# Altium schematic sheet 0031_DEBUG-XDP_SERIES_T.SchDoc
size A3
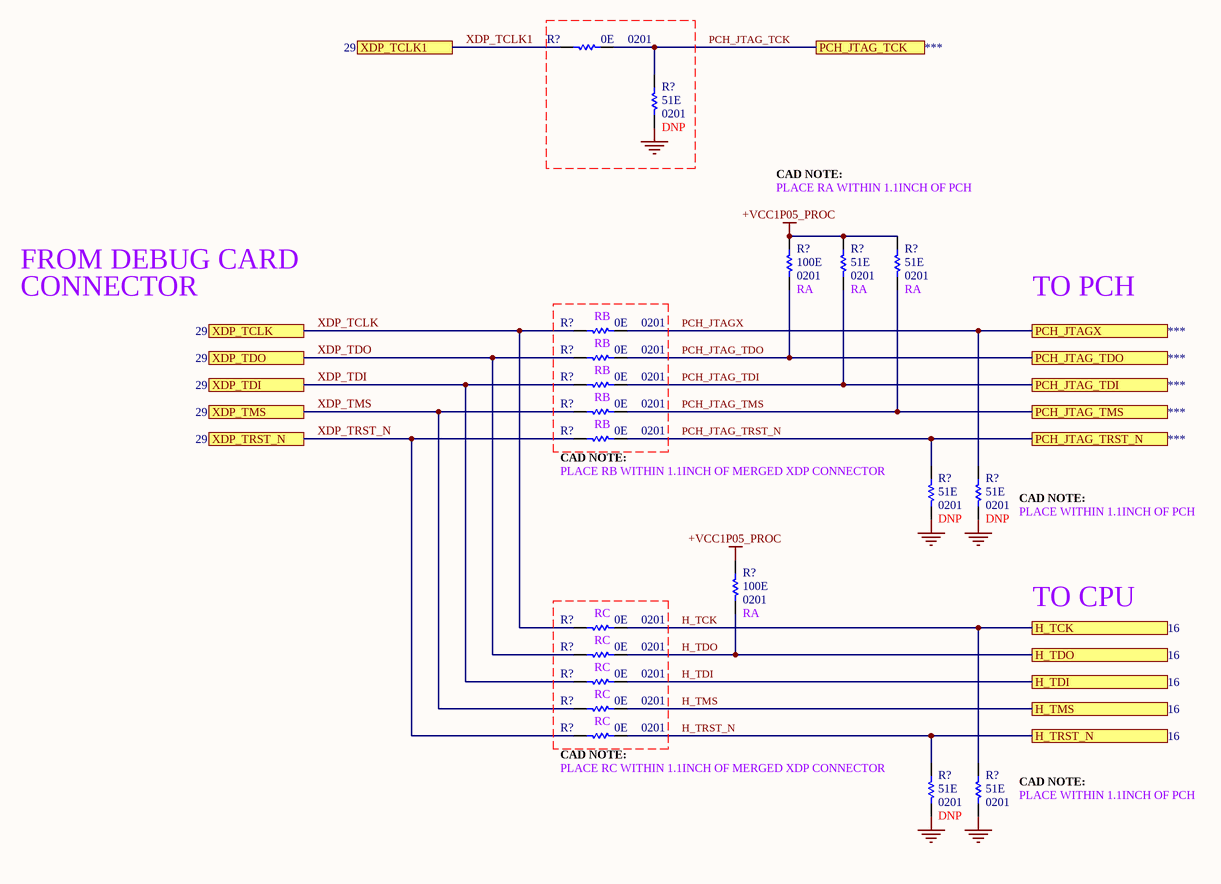
[diagram p0: 0031_DEBUG-XDP_SERIES_T.SchDoc]

## Parts
(Parts that share a designator on the sheet are numbered #1, #2 ... from top to bottom, then left to right.)
R?#1  value 0E  Case/Package: 0201  [RESC0201]  (hidden comment: Res)
R?#2  value 51E  Case/Package: 0201  [RESC0201]  (hidden comment: Res)
R?#3  value 100E  Case/Package: 0201  [RESC0201]  (hidden comment: Res)
R?#4  value 51E  Case/Package: 0201  [RESC0201]  (hidden comment: Res)
R?#5  value 51E  Case/Package: 0201  [RESC0201]  (hidden comment: Res)
R?#6  value 0E  Case/Package: 0201  [RESC0201]  (hidden comment: Res)
R?#7  value 0E  Case/Package: 0201  [RESC0201]  (hidden comment: Res)
R?#8  value 0E  Case/Package: 0201  [RESC0201]  (hidden comment: Res)
R?#9  value 0E  Case/Package: 0201  [RESC0201]  (hidden comment: Res)
R?#10  value 0E  Case/Package: 0201  [RESC0201]  (hidden comment: Res)
R?#11  value 51E  Case/Package: 0201  [RESC0201]  (hidden comment: Res)
R?#12  value 51E  Case/Package: 0201  [RESC0201]  (hidden comment: Res)
R?#13  value 100E  Case/Package: 0201  [RESC0201]  (hidden comment: Res)
R?#14  value 0E  Case/Package: 0201  [RESC0201]  (hidden comment: Res)
R?#15  value 0E  Case/Package: 0201  [RESC0201]  (hidden comment: Res)
R?#16  value 0E  Case/Package: 0201  [RESC0201]  (hidden comment: Res)
R?#17  value 0E  Case/Package: 0201  [RESC0201]  (hidden comment: Res)
R?#18  value 0E  Case/Package: 0201  [RESC0201]  (hidden comment: Res)
R?#19  value 51E  Case/Package: 0201  [RESC0201]  (hidden comment: Res)
R?#20  value 51E  Case/Package: 0201  [RESC0201]  (hidden comment: Res)

## Ports
H_TCK, H_TDI, H_TDO, H_TMS, H_TRST_N, PCH_JTAG_TCK, PCH_JTAG_TDI, PCH_JTAG_TDO, PCH_JTAG_TMS, PCH_JTAG_TRST_N, PCH_JTAGX, XDP_TCLK, XDP_TCLK1, XDP_TDI, XDP_TDO, XDP_TMS, XDP_TRST_N

## Nets
+VCC1P05_PROC: R?#3.2 R?#4.2 R?#5.2 R?#13.2
GND: R?#2.1 R?#11.1 R?#12.1 R?#19.1 R?#20.1
H_TCK: R?#14.2 R?#20.2 ; port H_TCK
H_TDI: R?#16.2 ; port H_TDI
H_TDO: R?#13.1 R?#15.2 ; port H_TDO
H_TMS: R?#17.2 ; port H_TMS
H_TRST_N: R?#18.2 R?#19.2 ; port H_TRST_N
PCH_JTAG_TCK: R?#1.2 R?#2.2 ; port PCH_JTAG_TCK
PCH_JTAG_TDI: R?#4.1 R?#8.2 ; port PCH_JTAG_TDI
PCH_JTAG_TDO: R?#3.1 R?#7.2 ; port PCH_JTAG_TDO
PCH_JTAG_TMS: R?#5.1 R?#9.2 ; port PCH_JTAG_TMS
PCH_JTAG_TRST_N: R?#10.2 R?#11.2 ; port PCH_JTAG_TRST_N
PCH_JTAGX: R?#6.2 R?#12.2 ; port PCH_JTAGX
XDP_TCLK: R?#6.1 R?#14.1 ; port XDP_TCLK
XDP_TCLK1: R?#1.1 ; port XDP_TCLK1
XDP_TDI: R?#8.1 R?#16.1 ; port XDP_TDI
XDP_TDO: R?#7.1 R?#15.1 ; port XDP_TDO
XDP_TMS: R?#9.1 R?#17.1 ; port XDP_TMS
XDP_TRST_N: R?#10.1 R?#18.1 ; port XDP_TRST_N

## Notes on the sheet
- CAD NOTE:
- PLACE RA WITHIN 1.1INCH OF PCH
- FROM DEBUG CARD
- CONNECTOR
- (near R?#6) RB
- (near R?#3) RA
- (near R?#4) RA
- (near R?#5) RA
- TO PCH
- (near R?#7) RB
- (near R?#8) RB
- (near R?#10) CAD NOTE:
- (near R?#10) PLACE RB WITHIN 1.1INCH OF MERGED XDP CONNECTOR
- (near R?#9) RB
- (near R?#12) CAD NOTE:
- (near R?#12) PLACE WITHIN 1.1INCH OF PCH
- (near R?#14) RC
- (near R?#13) RA
- TO CPU
- (near R?#15) RC
- (near R?#18) CAD NOTE:
- (near R?#16) RC
- (near R?#17) RC
- (near R?#18) PLACE RC WITHIN 1.1INCH OF MERGED XDP CONNECTOR
- (near R?#20) CAD NOTE:
- (near R?#20) PLACE WITHIN 1.1INCH OF PCH

## Library data of the parts
R?#1 R?#6-R?#10 R?#14-R?#18 = Res: Thick Film Resistor -  0ohm, 1%, 0201
R?#2 R?#4 R?#5 R?#11 R?#12 R?#19 R?#20 = Res: Thick Film Resistor -  51ohm, 1%, 0201
  R?#2 R?#11 R?#12 R?#19: DNP: DNP
R?#3 R?#13 = Res: Thick Film Resistor -  100ohm, 1%, 0201